# Altium schematic sheet 04 - SAMA7G54-PIO.SchDoc
size B; CompanyName: Microchip Technology Inc.; Organization: Microchip Technology; Address1: 2355 West Chandler Blvd.; Address2: Chandler, AZ  85224; Address4: USA; SheetNumber: 5; SheetTotal: 15; SheetTitle: SAMA7G5-PIO; Time: Time
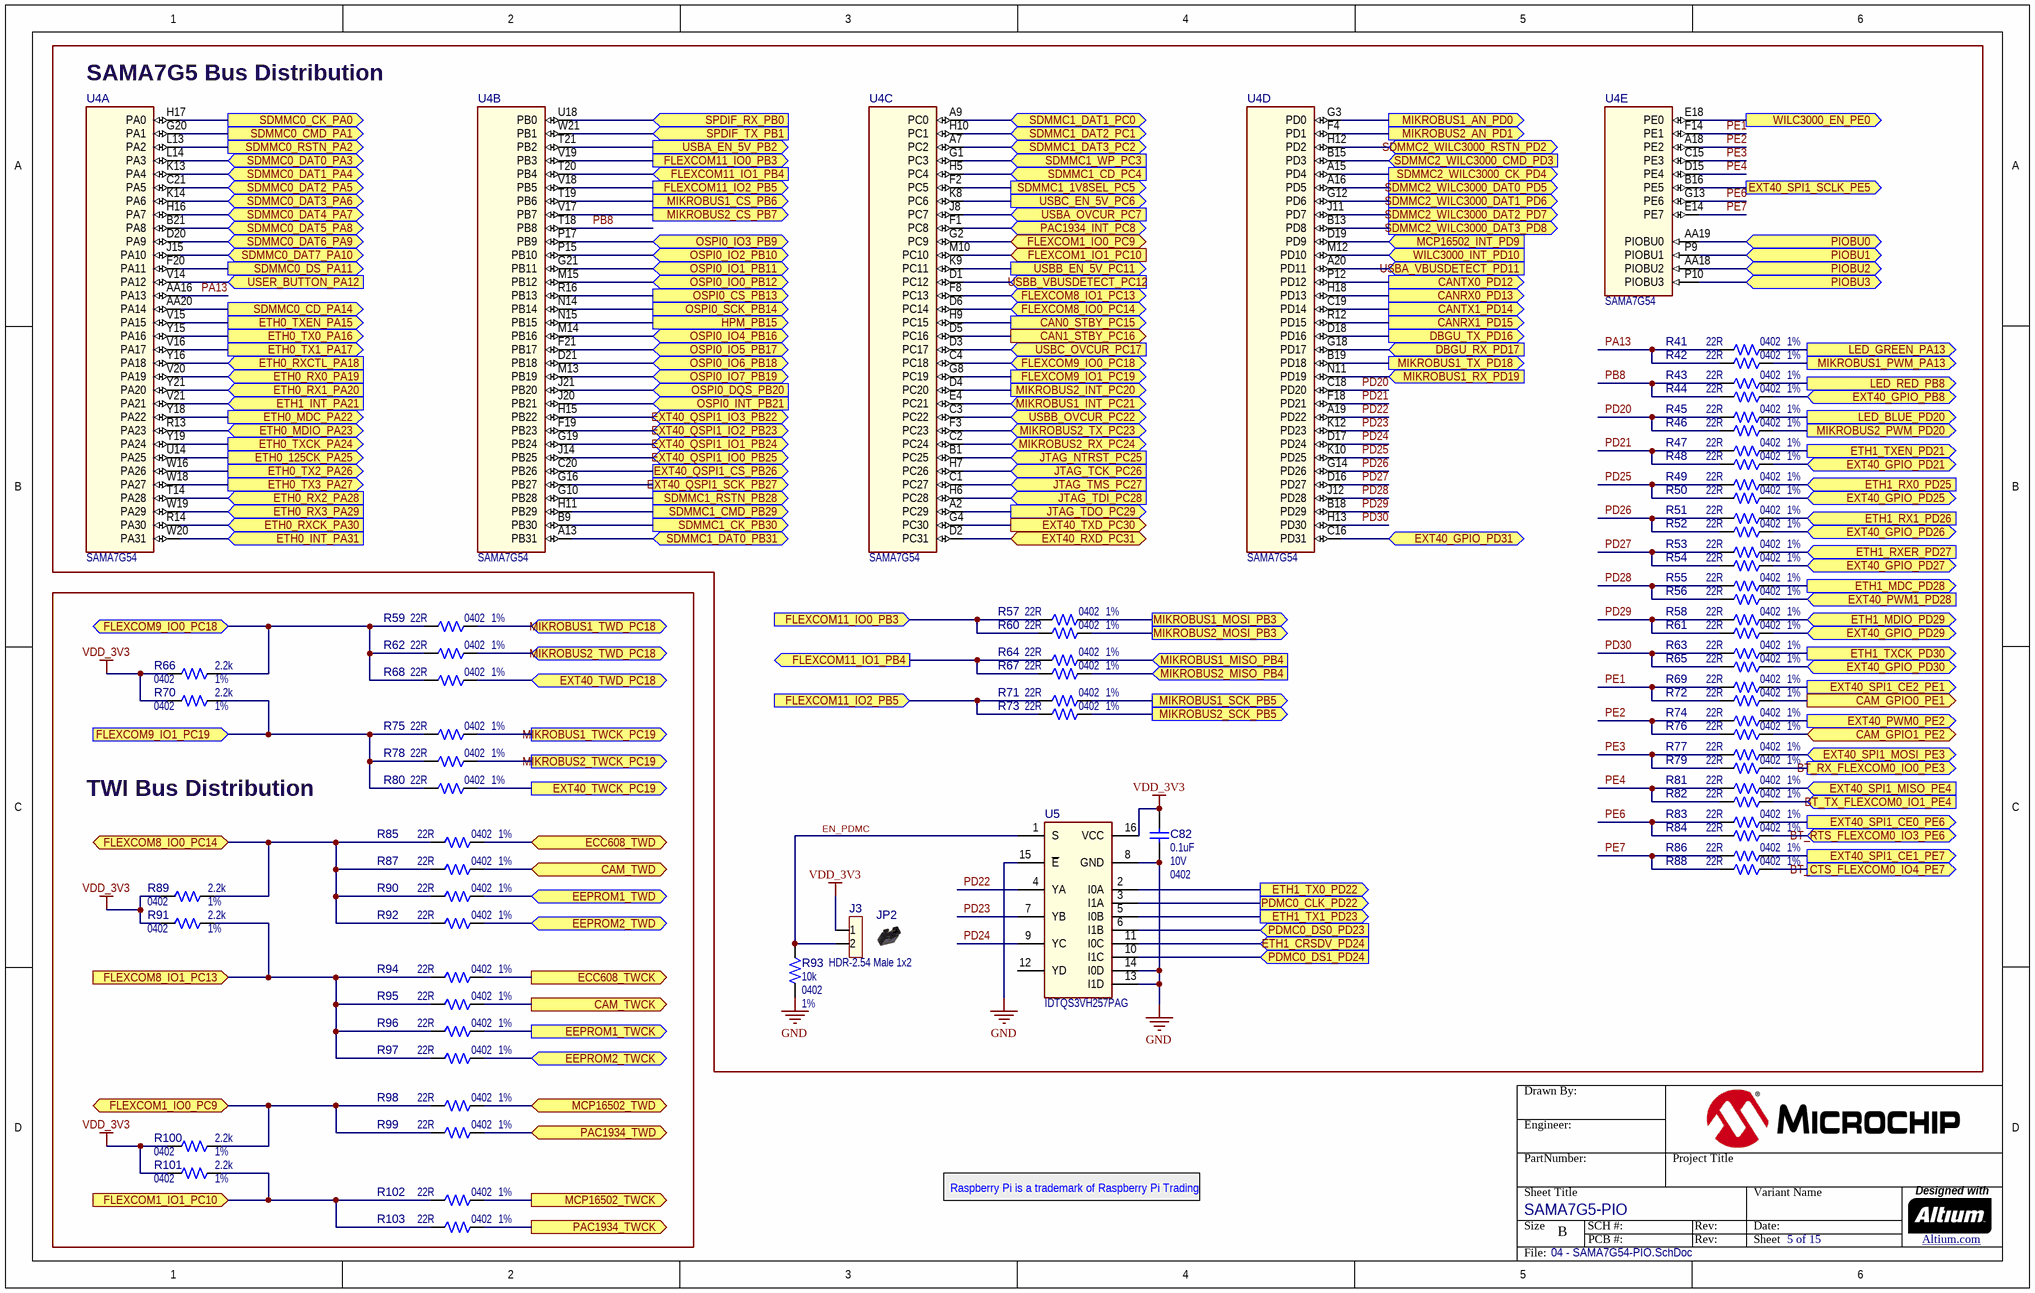
[diagram p0: 04 - SAMA7G54-PIO.SchDoc]

## Parts
?  (no value)  (graphical)
C82  value 0.1uF  Voltage: 10V  Package: 0402  [CAP_C_0402]  (hidden comment: Capacitor NP)
J3  value HDR-2.54 Male 1x2  [HDR_M_2.54_1x2]  (hidden comment: Header 1x2)
JP2  Jumper Mechanical  [Jumper_Mechanical]  (value not drawn)  (mechanical)
R41  value 22R  Package: 0402  Tolerance: 1%  [RES_C_0402]  (hidden comment: Resistor)
R42  value 22R  Package: 0402  Tolerance: 1%  [RES_C_0402]  (hidden comment: Resistor)
R43  value 22R  Package: 0402  Tolerance: 1%  [RES_C_0402]  (hidden comment: Resistor)
R44  value 22R  Package: 0402  Tolerance: 1%  [RES_C_0402]  (hidden comment: Resistor)
R45  value 22R  Package: 0402  Tolerance: 1%  [RES_C_0402]  (hidden comment: Resistor)
R46  value 22R  Package: 0402  Tolerance: 1%  [RES_C_0402]  (hidden comment: Resistor)
R47  value 22R  Package: 0402  Tolerance: 1%  [RES_C_0402]  (hidden comment: Resistor)
R48  value 22R  Package: 0402  Tolerance: 1%  [RES_C_0402]  (hidden comment: Resistor)
R49  value 22R  Package: 0402  Tolerance: 1%  [RES_C_0402]  (hidden comment: Resistor)
R50  value 22R  Package: 0402  Tolerance: 1%  [RES_C_0402]  (hidden comment: Resistor)
R51  value 22R  Package: 0402  Tolerance: 1%  [RES_C_0402]  (hidden comment: Resistor)
R52  value 22R  Package: 0402  Tolerance: 1%  [RES_C_0402]  (hidden comment: Resistor)
R53  value 22R  Package: 0402  Tolerance: 1%  [RES_C_0402]  (hidden comment: Resistor)
R54  value 22R  Package: 0402  Tolerance: 1%  [RES_C_0402]  (hidden comment: Resistor)
R55  value 22R  Package: 0402  Tolerance: 1%  [RES_C_0402]  (hidden comment: Resistor)
R56  value 22R  Package: 0402  Tolerance: 1%  [RES_C_0402]  (hidden comment: Resistor)
R57  value 22R  Package: 0402  Tolerance: 1%  [RES_C_0402]  (hidden comment: Resistor)
R58  value 22R  Package: 0402  Tolerance: 1%  [RES_C_0402]  (hidden comment: Resistor)
R59  value 22R  Package: 0402  Tolerance: 1%  [RES_C_0402]  (hidden comment: Resistor)
R60  value 22R  Package: 0402  Tolerance: 1%  [RES_C_0402]  (hidden comment: Resistor)
R61  value 22R  Package: 0402  Tolerance: 1%  [RES_C_0402]  (hidden comment: Resistor)
R62  value 22R  Package: 0402  Tolerance: 1%  [RES_C_0402]  (hidden comment: Resistor)
R63  value 22R  Package: 0402  Tolerance: 1%  [RES_C_0402]  (hidden comment: Resistor)
R64  value 22R  Package: 0402  Tolerance: 1%  [RES_C_0402]  (hidden comment: Resistor)
R65  value 22R  Package: 0402  Tolerance: 1%  [RES_C_0402]  (hidden comment: Resistor)
R66  value 2.2k  Package: 0402  Tolerance: 1%  [RES_C_0402]  (hidden comment: Resistor)
R67  value 22R  Package: 0402  Tolerance: 1%  [RES_C_0402]  (hidden comment: Resistor)
R68  value 22R  Package: 0402  Tolerance: 1%  [RES_C_0402]  (hidden comment: Resistor)
R69  value 22R  Package: 0402  Tolerance: 1%  [RES_C_0402]  (hidden comment: Resistor)
R70  value 2.2k  Package: 0402  Tolerance: 1%  [RES_C_0402]  (hidden comment: Resistor)
R71  value 22R  Package: 0402  Tolerance: 1%  [RES_C_0402]  (hidden comment: Resistor)
R72  value 22R  Package: 0402  Tolerance: 1%  [RES_C_0402]  (hidden comment: Resistor)
R73  value 22R  Package: 0402  Tolerance: 1%  [RES_C_0402]  (hidden comment: Resistor)
R74  value 22R  Package: 0402  Tolerance: 1%  [RES_C_0402]  (hidden comment: Resistor)
R75  value 22R  Package: 0402  Tolerance: 1%  [RES_C_0402]  (hidden comment: Resistor)
R76  value 22R  Package: 0402  Tolerance: 1%  [RES_C_0402]  (hidden comment: Resistor)
R77  value 22R  Package: 0402  Tolerance: 1%  [RES_C_0402]  (hidden comment: Resistor)
R78  value 22R  Package: 0402  Tolerance: 1%  [RES_C_0402]  (hidden comment: Resistor)
R79  value 22R  Package: 0402  Tolerance: 1%  [RES_C_0402]  (hidden comment: Resistor)
R80  value 22R  Package: 0402  Tolerance: 1%  [RES_C_0402]  (hidden comment: Resistor)
R81  value 22R  Package: 0402  Tolerance: 1%  [RES_C_0402]  (hidden comment: Resistor)
R82  value 22R  Package: 0402  Tolerance: 1%  [RES_C_0402]  (hidden comment: Resistor)
R83  value 22R  Package: 0402  Tolerance: 1%  [RES_C_0402]  (hidden comment: Resistor)
R84  value 22R  Package: 0402  Tolerance: 1%  [RES_C_0402]  (hidden comment: Resistor)
R85  value 22R  Package: 0402  Tolerance: 1%  [RES_C_0402]  (hidden comment: Resistor)
R86  value 22R  Package: 0402  Tolerance: 1%  [RES_C_0402]  (hidden comment: Resistor)
R87  value 22R  Package: 0402  Tolerance: 1%  [RES_C_0402]  (hidden comment: Resistor)
R88  value 22R  Package: 0402  Tolerance: 1%  [RES_C_0402]  (hidden comment: Resistor)
R89  value 2.2k  Package: 0402  Tolerance: 1%  [RES_C_0402]  (hidden comment: Resistor)
R90  value 22R  Package: 0402  Tolerance: 1%  [RES_C_0402]  (hidden comment: Resistor)
R91  value 2.2k  Package: 0402  Tolerance: 1%  [RES_C_0402]  (hidden comment: Resistor)
R92  value 22R  Package: 0402  Tolerance: 1%  [RES_C_0402]  (hidden comment: Resistor)
R93  value 10k  Package: 0402  Tolerance: 1%  [RES_C_0402]  (hidden comment: Resistor)
R94  value 22R  Package: 0402  Tolerance: 1%  [RES_C_0402]  (hidden comment: Resistor)
R95  value 22R  Package: 0402  Tolerance: 1%  [RES_C_0402]  (hidden comment: Resistor)
R96  value 22R  Package: 0402  Tolerance: 1%  [RES_C_0402]  (hidden comment: Resistor)
R97  value 22R  Package: 0402  Tolerance: 1%  [RES_C_0402]  (hidden comment: Resistor)
R98  value 22R  Package: 0402  Tolerance: 1%  [RES_C_0402]  (hidden comment: Resistor)
R99  value 22R  Package: 0402  Tolerance: 1%  [RES_C_0402]  (hidden comment: Resistor)
R100  value 2.2k  Package: 0402  Tolerance: 1%  [RES_C_0402]  (hidden comment: Resistor)
R101  value 2.2k  Package: 0402  Tolerance: 1%  [RES_C_0402]  (hidden comment: Resistor)
R102  value 22R  Package: 0402  Tolerance: 1%  [RES_C_0402]  (hidden comment: Resistor)
R103  value 22R  Package: 0402  Tolerance: 1%  [RES_C_0402]  (hidden comment: Resistor)
U4  SAMA7G54  [TFBGA-343_14x14]  (parts A,B,C,D,E of 8)
U5  value IDTQS3VH257PAG  [TSSOP-16]  (hidden comment: IDTQS3VH257 TSSOP-16)

## Blocks framed on the sheet
SAMA7G5 Bus Distribution: C82 J3 JP2 R41-R58 R60 R61 R63-R65 R67 R69 R71-R74 R76 R77 R79 R81-R84 R86 R88 R93 U4 U5
TWI Bus Distribution: R59 R62 R66 R68 R70 R75 R78 R80 R85 R87 R89-R92 R94-R103

## Ports
BT_CTS_FLEXCOM0_IO4_PE7 (out), BT_RTS_FLEXCOM0_IO3_PE6 (bidir), BT_RX_FLEXCOM0_IO0_PE3 (out), BT_TX_FLEXCOM0_IO1_PE4 (in), CAM_GPIO0_PE1 (out), CAM_GPIO1_PE2 (bidir), CAM_TWCK (out), CAM_TWD (bidir), CAN0_STBY_PC15 (out), CAN1_STBY_PC16 (out), CANRX0_PD13 (out), CANRX1_PD15 (out), CANTX0_PD12 (out), CANTX1_PD14 (out), DBGU_RX_PD17 (in), DBGU_TX_PD16 (out), ECC608_TWCK (out), ECC608_TWD (bidir), EEPROM1_TWCK (out), EEPROM1_TWD (bidir), EEPROM2_TWCK (bidir), EEPROM2_TWD (bidir), ETH0_125CK_PA25 (out), ETH0_INT_PA31 (in), ETH0_MDC_PA22 (out), ETH0_MDIO_PA23 (bidir), ETH0_RX0_PA19 (in), ETH0_RX1_PA20 (in), ETH0_RX2_PA28 (in), ETH0_RX3_PA29 (in), ETH0_RXCK_PA30 (in), ETH0_RXCTL_PA18 (in), ETH0_TX0_PA16 (out), ETH0_TX1_PA17 (out), ETH0_TX2_PA26 (out), ETH0_TX3_PA27 (out), ETH0_TXCK_PA24 (out), ETH0_TXEN_PA15 (out), ETH1_CRSDV_PD24 (in), ETH1_INT_PA21 (in), ETH1_MDC_PD28 (out), ETH1_MDIO_PD29 (bidir), ETH1_RX0_PD25 (in), ETH1_RX1_PD26 (in), ETH1_RXER_PD27 (in), ETH1_TX0_PD22 (out), ETH1_TX1_PD23 (out), ETH1_TXCK_PD30 (out), ETH1_TXEN_PD21 (out), EXT40_GPIO_PB8 (bidir), EXT40_GPIO_PD21 (bidir), EXT40_GPIO_PD25 (bidir), EXT40_GPIO_PD26 (bidir), EXT40_GPIO_PD27 (bidir), EXT40_GPIO_PD29 (bidir), EXT40_GPIO_PD30 (bidir), EXT40_GPIO_PD31 (bidir), EXT40_PWM0_PE2 (out), EXT40_PWM1_PD28 (in), EXT40_QSPI1_CS_PB26 (out), EXT40_QSPI1_IO0_PB25 (bidir), EXT40_QSPI1_IO1_PB24 (bidir), EXT40_QSPI1_IO2_PB23 (bidir), EXT40_QSPI1_IO3_PB22 (bidir), EXT40_QSPI1_SCK_PB27 (out), EXT40_RXD_PC31 (bidir), EXT40_SPI1_CE0_PE6 (out), EXT40_SPI1_CE1_PE7 (out), EXT40_SPI1_CE2_PE1 (out), EXT40_SPI1_MISO_PE4 (in), EXT40_SPI1_MOSI_PE3 (bidir), EXT40_SPI1_SCLK_PE5 (out), EXT40_TWCK_PC19 (out), EXT40_TWD_PC18 (bidir), EXT40_TXD_PC30 (out), FLEXCOM1_IO0_PC9 (bidir), FLEXCOM1_IO1_PC10 (in), FLEXCOM8_IO0_PC14 (bidir), FLEXCOM8_IO1_PC13 (bidir), FLEXCOM8_IO1_PC13 (in), FLEXCOM9_IO0_PC18 (bidir), FLEXCOM9_IO1_PC19 (in), FLEXCOM9_IO1_PC19 (out), FLEXCOM11_IO0_PB3 (in), FLEXCOM11_IO0_PB3 (out), FLEXCOM11_IO1_PB4 (in), FLEXCOM11_IO1_PB4 (out), FLEXCOM11_IO2_PB5 (in), FLEXCOM11_IO2_PB5 (out), HPM_PB15 (out), JTAG_NTRST_PC25 (in), JTAG_TCK_PC26 (in), JTAG_TDI_PC28 (in), JTAG_TDO_PC29 (out), JTAG_TMS_PC27 (in), LED_BLUE_PD20 (out), LED_GREEN_PA13 (out), LED_RED_PB8 (out), MCP16502_INT_PD9 (in), MCP16502_TWCK (out), MCP16502_TWD (bidir), MIKROBUS1_AN_PD0 (out), MIKROBUS1_CS_PB6 (out), MIKROBUS1_INT_PC21 (bidir), MIKROBUS1_MISO_PB4 (in), MIKROBUS1_MOSI_PB3 (out), MIKROBUS1_PWM_PA13 (out), MIKROBUS1_RX_PD19 (in), MIKROBUS1_SCK_PB5 (out), MIKROBUS1_TWCK_PC19 (out), MIKROBUS1_TWD_PC18 (bidir), MIKROBUS1_TX_PD18 (out), MIKROBUS2_AN_PD1 (out), MIKROBUS2_CS_PB7 (out), MIKROBUS2_INT_PC20 (out), MIKROBUS2_MISO_PB4 (in), MIKROBUS2_MOSI_PB3 (out), MIKROBUS2_PWM_PD20 (out), MIKROBUS2_RX_PC24 (bidir), MIKROBUS2_SCK_PB5 (out), MIKROBUS2_TWCK_PC19 (out), MIKROBUS2_TWD_PC18 (bidir), MIKROBUS2_TX_PC23 (bidir), OSPI0_CS_PB13 (out), OSPI0_DQS_PB20 (in), OSPI0_INT_PB21 (in), OSPI0_IO0_PB12 (bidir), OSPI0_IO1_PB11 (bidir), OSPI0_IO2_PB10 (bidir), OSPI0_IO3_PB9 (bidir), OSPI0_IO4_PB16 (bidir), OSPI0_IO5_PB17 (bidir), OSPI0_IO6_PB18 (bidir), OSPI0_IO7_PB19 (bidir), OSPI0_SCK_PB14 (out), PAC1934_INT_PC8 (bidir), PAC1934_TWCK (out), PAC1934_TWD (bidir), PDMC0_CLK_PD22 (out), PDMC0_DS0_PD23 (in), PDMC0_DS1_PD24 (in), PIOBU0 (bidir), PIOBU1 (bidir), PIOBU2 (bidir), PIOBU3 (bidir), SDMMC0_CD_PA14 (out), SDMMC0_CK_PA0 (out), SDMMC0_CMD_PA1 (out), SDMMC0_DAT0_PA3 (bidir), SDMMC0_DAT1_PA4 (bidir), SDMMC0_DAT2_PA5 (bidir), SDMMC0_DAT3_PA6 (bidir), SDMMC0_DAT4_PA7 (bidir), SDMMC0_DAT5_PA8 (bidir), SDMMC0_DAT6_PA9 (bidir), SDMMC0_DAT7_PA10 (bidir), SDMMC0_DS_PA11 (out), SDMMC0_RSTN_PA2 (out), SDMMC1_1V8SEL_PC5 (out), SDMMC1_CD_PC4 (in), SDMMC1_CK_PB30 (out), SDMMC1_CMD_PB29 (out), SDMMC1_DAT0_PB31 (bidir), SDMMC1_DAT1_PC0 (bidir), SDMMC1_DAT2_PC1 (bidir), SDMMC1_DAT3_PC2 (bidir), SDMMC1_RSTN_PB28 (out), SDMMC1_WP_PC3 (in), SDMMC2_WILC3000_CK_PD4 (out), SDMMC2_WILC3000_CMD_PD3 (in), SDMMC2_WILC3000_DAT0_PD5 (out), SDMMC2_WILC3000_DAT1_PD6 (out), SDMMC2_WILC3000_DAT2_PD7 (out), SDMMC2_WILC3000_DAT3_PD8 (out), SDMMC2_WILC3000_RSTN_PD2 (bidir), SPDIF_RX_PB0 (in), SPDIF_TX_PB1 (in), USBA_EN_5V_PB2 (out), USBA_OVCUR_PC7 (in), USBA_VBUSDETECT_PD11 (in), USBB_EN_5V_PC11 (out), USBB_OVCUR_PC22 (bidir), USBB_VBUSDETECT_PC12 (in), USBC_EN_5V_PC6 (out), USBC_OVCUR_PC17 (in), USER_BUTTON_PA12 (in), WILC3000_EN_PE0 (out), WILC3000_INT_PD10 (in)

## Nets
GND: C82.2 R93.2 U5.8(GND) U5.13(I1D) U5.14(I0D) U5.15(~{E})
VDD_3V3: C82.1 J3.1 R66.2 R70.2 R89.2 R91.2 R100.2 R101.2 U5.16(VCC)
BT_CTS_FLEXCOM0_IO4_PE7: R88.2 ; port BT_CTS_FLEXCOM0_IO4_PE7
BT_RTS_FLEXCOM0_IO3_PE6: R84.2 ; port BT_RTS_FLEXCOM0_IO3_PE6
BT_RX_FLEXCOM0_IO0_PE3: R79.2 ; port BT_RX_FLEXCOM0_IO0_PE3
BT_TX_FLEXCOM0_IO1_PE4: R82.2 ; port BT_TX_FLEXCOM0_IO1_PE4
CAM_GPIO0_PE1: R72.2 ; port CAM_GPIO0_PE1
CAM_GPIO1_PE2: R76.2 ; port CAM_GPIO1_PE2
CAM_TWCK: R95.2 ; port CAM_TWCK
CAM_TWD: R87.2 ; port CAM_TWD
CAN0_STBY_PC15: U4.H9(PC15) ; port CAN0_STBY_PC15
CAN1_STBY_PC16: U4.D5(PC16) ; port CAN1_STBY_PC16
CANRX0_PD13: U4.H18(PD13) ; port CANRX0_PD13
CANRX1_PD15: U4.R12(PD15) ; port CANRX1_PD15
CANTX0_PD12: U4.P12(PD12) ; port CANTX0_PD12
CANTX1_PD14: U4.C19(PD14) ; port CANTX1_PD14
DBGU_RX_PD17: U4.G18(PD17) ; port DBGU_RX_PD17
DBGU_TX_PD16: U4.D18(PD16) ; port DBGU_TX_PD16
ECC608_TWCK: R94.2 ; port ECC608_TWCK
ECC608_TWD: R85.2 ; port ECC608_TWD
EEPROM1_TWCK: R96.2 ; port EEPROM1_TWCK
EEPROM1_TWD: R90.2 ; port EEPROM1_TWD
EEPROM2_TWCK: R97.2 ; port EEPROM2_TWCK
EEPROM2_TWD: R92.2 ; port EEPROM2_TWD
EN_PDMC: J3.2 R93.1 U5.1(S)
ETH0_125CK_PA25: U4.U14(PA25) ; port ETH0_125CK_PA25
ETH0_INT_PA31: U4.W20(PA31) ; port ETH0_INT_PA31
ETH0_MDC_PA22: U4.Y18(PA22) ; port ETH0_MDC_PA22
ETH0_MDIO_PA23: U4.R13(PA23) ; port ETH0_MDIO_PA23
ETH0_RX0_PA19: U4.V20(PA19) ; port ETH0_RX0_PA19
ETH0_RX1_PA20: U4.Y21(PA20) ; port ETH0_RX1_PA20
ETH0_RX2_PA28: U4.T14(PA28) ; port ETH0_RX2_PA28
ETH0_RX3_PA29: U4.W19(PA29) ; port ETH0_RX3_PA29
ETH0_RXCK_PA30: U4.R14(PA30) ; port ETH0_RXCK_PA30
ETH0_RXCTL_PA18: U4.Y16(PA18) ; port ETH0_RXCTL_PA18
ETH0_TX0_PA16: U4.Y15(PA16) ; port ETH0_TX0_PA16
ETH0_TX1_PA17: U4.V16(PA17) ; port ETH0_TX1_PA17
ETH0_TX2_PA26: U4.W16(PA26) ; port ETH0_TX2_PA26
ETH0_TX3_PA27: U4.W18(PA27) ; port ETH0_TX3_PA27
ETH0_TXCK_PA24: U4.Y19(PA24) ; port ETH0_TXCK_PA24
ETH0_TXEN_PA15: U4.V15(PA15) ; port ETH0_TXEN_PA15
ETH1_CRSDV_PD24: U5.11(I0C) ; port ETH1_CRSDV_PD24
ETH1_INT_PA21: U4.V21(PA21) ; port ETH1_INT_PA21
ETH1_MDC_PD28: R55.2 ; port ETH1_MDC_PD28
ETH1_MDIO_PD29: R58.2 ; port ETH1_MDIO_PD29
ETH1_RX0_PD25: R49.2 ; port ETH1_RX0_PD25
ETH1_RX1_PD26: R51.2 ; port ETH1_RX1_PD26
ETH1_RXER_PD27: R53.2 ; port ETH1_RXER_PD27
ETH1_TX0_PD22: U5.2(I0A) ; port ETH1_TX0_PD22
ETH1_TX1_PD23: U5.5(I0B) ; port ETH1_TX1_PD23
ETH1_TXCK_PD30: R63.2 ; port ETH1_TXCK_PD30
ETH1_TXEN_PD21: R47.2 ; port ETH1_TXEN_PD21
EXT40_GPIO_PB8: R44.2 ; port EXT40_GPIO_PB8
EXT40_GPIO_PD21: R48.2 ; port EXT40_GPIO_PD21
EXT40_GPIO_PD25: R50.2 ; port EXT40_GPIO_PD25
EXT40_GPIO_PD26: R52.2 ; port EXT40_GPIO_PD26
EXT40_GPIO_PD27: R54.2 ; port EXT40_GPIO_PD27
EXT40_GPIO_PD29: R61.2 ; port EXT40_GPIO_PD29
EXT40_GPIO_PD30: R65.2 ; port EXT40_GPIO_PD30
EXT40_GPIO_PD31: U4.C16(PD31) ; port EXT40_GPIO_PD31
EXT40_PWM0_PE2: R74.2 ; port EXT40_PWM0_PE2
EXT40_PWM1_PD28: R56.2 ; port EXT40_PWM1_PD28
EXT40_QSPI1_CS_PB26: U4.C20(PB26) ; port EXT40_QSPI1_CS_PB26
EXT40_QSPI1_IO0_PB25: U4.J14(PB25) ; port EXT40_QSPI1_IO0_PB25
EXT40_QSPI1_IO1_PB24: U4.G19(PB24) ; port EXT40_QSPI1_IO1_PB24
EXT40_QSPI1_IO2_PB23: U4.F19(PB23) ; port EXT40_QSPI1_IO2_PB23
EXT40_QSPI1_IO3_PB22: U4.H15(PB22) ; port EXT40_QSPI1_IO3_PB22
EXT40_QSPI1_SCK_PB27: U4.G16(PB27) ; port EXT40_QSPI1_SCK_PB27
EXT40_RXD_PC31: U4.D2(PC31) ; port EXT40_RXD_PC31
EXT40_SPI1_CE0_PE6: R83.2 ; port EXT40_SPI1_CE0_PE6
EXT40_SPI1_CE1_PE7: R86.2 ; port EXT40_SPI1_CE1_PE7
EXT40_SPI1_CE2_PE1: R69.2 ; port EXT40_SPI1_CE2_PE1
EXT40_SPI1_MISO_PE4: R81.2 ; port EXT40_SPI1_MISO_PE4
EXT40_SPI1_MOSI_PE3: R77.2 ; port EXT40_SPI1_MOSI_PE3
EXT40_SPI1_SCLK_PE5: U4.B16(PE5) ; port EXT40_SPI1_SCLK_PE5
EXT40_TWCK_PC19: R80.2 ; port EXT40_TWCK_PC19
EXT40_TWD_PC18: R68.2 ; port EXT40_TWD_PC18
EXT40_TXD_PC30: U4.G4(PC30) ; port EXT40_TXD_PC30
FLEXCOM1_IO0_PC9: R98.1 R99.1 R100.1 U4.G2(PC9) ; port FLEXCOM1_IO0_PC9
FLEXCOM1_IO1_PC10: R101.1 R102.1 R103.1 U4.M10(PC10) ; port FLEXCOM1_IO1_PC10
FLEXCOM8_IO0_PC14: R85.1 R87.1 R89.1 R90.1 R92.1 U4.D6(PC14) ; port FLEXCOM8_IO0_PC14
FLEXCOM8_IO1_PC13: R91.1 R94.1 R95.1 R96.1 R97.1 U4.F8(PC13) ; port FLEXCOM8_IO1_PC13
FLEXCOM9_IO0_PC18: R59.1 R62.1 R66.1 R68.1 U4.C4(PC18) ; port FLEXCOM9_IO0_PC18
FLEXCOM9_IO1_PC19: R70.1 R75.1 R78.1 R80.1 U4.G8(PC19) ; port FLEXCOM9_IO1_PC19
FLEXCOM11_IO0_PB3: R57.1 R60.1 U4.V19(PB3) ; port FLEXCOM11_IO0_PB3
FLEXCOM11_IO1_PB4: R64.1 R67.1 U4.T20(PB4) ; port FLEXCOM11_IO1_PB4
FLEXCOM11_IO2_PB5: R71.1 R73.1 U4.V18(PB5) ; port FLEXCOM11_IO2_PB5
HPM_PB15: U4.N15(PB15) ; port HPM_PB15
JTAG_NTRST_PC25: U4.B1(PC25) ; port JTAG_NTRST_PC25
JTAG_TCK_PC26: U4.H7(PC26) ; port JTAG_TCK_PC26
JTAG_TDI_PC28: U4.H6(PC28) ; port JTAG_TDI_PC28
JTAG_TDO_PC29: U4.A2(PC29) ; port JTAG_TDO_PC29
JTAG_TMS_PC27: U4.C1(PC27) ; port JTAG_TMS_PC27
LED_BLUE_PD20: R45.2 ; port LED_BLUE_PD20
LED_GREEN_PA13: R41.2 ; port LED_GREEN_PA13
LED_RED_PB8: R43.2 ; port LED_RED_PB8
MCP16502_INT_PD9: U4.D19(PD9) ; port MCP16502_INT_PD9
MCP16502_TWCK: R102.2 ; port MCP16502_TWCK
MCP16502_TWD: R98.2 ; port MCP16502_TWD
MIKROBUS1_AN_PD0: U4.G3(PD0) ; port MIKROBUS1_AN_PD0
MIKROBUS1_CS_PB6: U4.T19(PB6) ; port MIKROBUS1_CS_PB6
MIKROBUS1_INT_PC21: U4.E4(PC21) ; port MIKROBUS1_INT_PC21
MIKROBUS1_MISO_PB4: R64.2 ; port MIKROBUS1_MISO_PB4
MIKROBUS1_MOSI_PB3: R57.2 ; port MIKROBUS1_MOSI_PB3
MIKROBUS1_PWM_PA13: R42.2 ; port MIKROBUS1_PWM_PA13
MIKROBUS1_RX_PD19: U4.N11(PD19) ; port MIKROBUS1_RX_PD19
MIKROBUS1_SCK_PB5: R71.2 ; port MIKROBUS1_SCK_PB5
MIKROBUS1_TWCK_PC19: R75.2 ; port MIKROBUS1_TWCK_PC19
MIKROBUS1_TWD_PC18: R59.2 ; port MIKROBUS1_TWD_PC18
MIKROBUS1_TX_PD18: U4.B19(PD18) ; port MIKROBUS1_TX_PD18
MIKROBUS2_AN_PD1: U4.F4(PD1) ; port MIKROBUS2_AN_PD1
MIKROBUS2_CS_PB7: U4.V17(PB7) ; port MIKROBUS2_CS_PB7
MIKROBUS2_INT_PC20: U4.D4(PC20) ; port MIKROBUS2_INT_PC20
MIKROBUS2_MISO_PB4: R67.2 ; port MIKROBUS2_MISO_PB4
MIKROBUS2_MOSI_PB3: R60.2 ; port MIKROBUS2_MOSI_PB3
MIKROBUS2_PWM_PD20: R46.2 ; port MIKROBUS2_PWM_PD20
MIKROBUS2_RX_PC24: U4.C2(PC24) ; port MIKROBUS2_RX_PC24
MIKROBUS2_SCK_PB5: R73.2 ; port MIKROBUS2_SCK_PB5
MIKROBUS2_TWCK_PC19: R78.2 ; port MIKROBUS2_TWCK_PC19
MIKROBUS2_TWD_PC18: R62.2 ; port MIKROBUS2_TWD_PC18
MIKROBUS2_TX_PC23: U4.F3(PC23) ; port MIKROBUS2_TX_PC23
OSPI0_CS_PB13: U4.R16(PB13) ; port OSPI0_CS_PB13
OSPI0_DQS_PB20: U4.J21(PB20) ; port OSPI0_DQS_PB20
OSPI0_INT_PB21: U4.J20(PB21) ; port OSPI0_INT_PB21
OSPI0_IO0_PB12: U4.M15(PB12) ; port OSPI0_IO0_PB12
OSPI0_IO1_PB11: U4.G21(PB11) ; port OSPI0_IO1_PB11
OSPI0_IO2_PB10: U4.P15(PB10) ; port OSPI0_IO2_PB10
OSPI0_IO3_PB9: U4.P17(PB9) ; port OSPI0_IO3_PB9
OSPI0_IO4_PB16: U4.M14(PB16) ; port OSPI0_IO4_PB16
OSPI0_IO5_PB17: U4.F21(PB17) ; port OSPI0_IO5_PB17
OSPI0_IO6_PB18: U4.D21(PB18) ; port OSPI0_IO6_PB18
OSPI0_IO7_PB19: U4.M13(PB19) ; port OSPI0_IO7_PB19
OSPI0_SCK_PB14: U4.N14(PB14) ; port OSPI0_SCK_PB14
PA13: R41.1 R42.1 U4.AA16(PA13)
PAC1934_INT_PC8: U4.F1(PC8) ; port PAC1934_INT_PC8
PAC1934_TWCK: R103.2 ; port PAC1934_TWCK
PAC1934_TWD: R99.2 ; port PAC1934_TWD
PB8: R43.1 R44.1 U4.T18(PB8)
PD20: R45.1 R46.1 U4.C18(PD20)
PD21: R47.1 R48.1 U4.F18(PD21)
PD22: U4.A19(PD22) U5.4(YA)
PD23: U4.K12(PD23) U5.7(YB)
PD24: U4.D17(PD24) U5.9(YC)
PD25: R49.1 R50.1 U4.K10(PD25)
PD26: R51.1 R52.1 U4.G14(PD26)
PD27: R53.1 R54.1 U4.D16(PD27)
PD28: R55.1 R56.1 U4.J12(PD28)
PD29: R58.1 R61.1 U4.B18(PD29)
PD30: R63.1 R65.1 U4.H13(PD30)
PDMC0_CLK_PD22: U5.3(I1A) ; port PDMC0_CLK_PD22
PDMC0_DS0_PD23: U5.6(I1B) ; port PDMC0_DS0_PD23
PDMC0_DS1_PD24: U5.10(I1C) ; port PDMC0_DS1_PD24
PE1: R69.1 R72.1 U4.F14(PE1)
PE2: R74.1 R76.1 U4.A18(PE2)
PE3: R77.1 R79.1 U4.C15(PE3)
PE4: R81.1 R82.1 U4.D15(PE4)
PE6: R83.1 R84.1 U4.G13(PE6)
PE7: R86.1 R88.1 U4.E14(PE7)
PIOBU0: U4.AA19(PIOBU0) ; port PIOBU0
PIOBU1: U4.P9(PIOBU1) ; port PIOBU1
PIOBU2: U4.AA18(PIOBU2) ; port PIOBU2
PIOBU3: U4.P10(PIOBU3) ; port PIOBU3
SDMMC0_CD_PA14: U4.AA20(PA14) ; port SDMMC0_CD_PA14
SDMMC0_CK_PA0: U4.H17(PA0) ; port SDMMC0_CK_PA0
SDMMC0_CMD_PA1: U4.G20(PA1) ; port SDMMC0_CMD_PA1
SDMMC0_DAT0_PA3: U4.L14(PA3) ; port SDMMC0_DAT0_PA3
SDMMC0_DAT1_PA4: U4.K13(PA4) ; port SDMMC0_DAT1_PA4
SDMMC0_DAT2_PA5: U4.C21(PA5) ; port SDMMC0_DAT2_PA5
SDMMC0_DAT3_PA6: U4.K14(PA6) ; port SDMMC0_DAT3_PA6
SDMMC0_DAT4_PA7: U4.H16(PA7) ; port SDMMC0_DAT4_PA7
SDMMC0_DAT5_PA8: U4.B21(PA8) ; port SDMMC0_DAT5_PA8
SDMMC0_DAT6_PA9: U4.D20(PA9) ; port SDMMC0_DAT6_PA9
SDMMC0_DAT7_PA10: U4.J15(PA10) ; port SDMMC0_DAT7_PA10
SDMMC0_DS_PA11: U4.F20(PA11) ; port SDMMC0_DS_PA11
SDMMC0_RSTN_PA2: U4.L13(PA2) ; port SDMMC0_RSTN_PA2
SDMMC1_1V8SEL_PC5: U4.F2(PC5) ; port SDMMC1_1V8SEL_PC5
SDMMC1_CD_PC4: U4.H5(PC4) ; port SDMMC1_CD_PC4
SDMMC1_CK_PB30: U4.B9(PB30) ; port SDMMC1_CK_PB30
SDMMC1_CMD_PB29: U4.H11(PB29) ; port SDMMC1_CMD_PB29
SDMMC1_DAT0_PB31: U4.A13(PB31) ; port SDMMC1_DAT0_PB31
SDMMC1_DAT1_PC0: U4.A9(PC0) ; port SDMMC1_DAT1_PC0
SDMMC1_DAT2_PC1: U4.H10(PC1) ; port SDMMC1_DAT2_PC1
SDMMC1_DAT3_PC2: U4.A7(PC2) ; port SDMMC1_DAT3_PC2
SDMMC1_RSTN_PB28: U4.G10(PB28) ; port SDMMC1_RSTN_PB28
SDMMC1_WP_PC3: U4.G1(PC3) ; port SDMMC1_WP_PC3
SDMMC2_WILC3000_CK_PD4: U4.A15(PD4) ; port SDMMC2_WILC3000_CK_PD4
SDMMC2_WILC3000_CMD_PD3: U4.B15(PD3) ; port SDMMC2_WILC3000_CMD_PD3
SDMMC2_WILC3000_DAT0_PD5: U4.A16(PD5) ; port SDMMC2_WILC3000_DAT0_PD5
SDMMC2_WILC3000_DAT1_PD6: U4.G12(PD6) ; port SDMMC2_WILC3000_DAT1_PD6
SDMMC2_WILC3000_DAT2_PD7: U4.J11(PD7) ; port SDMMC2_WILC3000_DAT2_PD7
SDMMC2_WILC3000_DAT3_PD8: U4.B13(PD8) ; port SDMMC2_WILC3000_DAT3_PD8
SDMMC2_WILC3000_RSTN_PD2: U4.H12(PD2) ; port SDMMC2_WILC3000_RSTN_PD2
SPDIF_RX_PB0: U4.U18(PB0) ; port SPDIF_RX_PB0
SPDIF_TX_PB1: U4.W21(PB1) ; port SPDIF_TX_PB1
USBA_EN_5V_PB2: U4.T21(PB2) ; port USBA_EN_5V_PB2
USBA_OVCUR_PC7: U4.J8(PC7) ; port USBA_OVCUR_PC7
USBA_VBUSDETECT_PD11: U4.A20(PD11) ; port USBA_VBUSDETECT_PD11
USBB_EN_5V_PC11: U4.K9(PC11) ; port USBB_EN_5V_PC11
USBB_OVCUR_PC22: U4.C3(PC22) ; port USBB_OVCUR_PC22
USBB_VBUSDETECT_PC12: U4.D1(PC12) ; port USBB_VBUSDETECT_PC12
USBC_EN_5V_PC6: U4.K8(PC6) ; port USBC_EN_5V_PC6
USBC_OVCUR_PC17: U4.D3(PC17) ; port USBC_OVCUR_PC17
USER_BUTTON_PA12: U4.V14(PA12) ; port USER_BUTTON_PA12
WILC3000_EN_PE0: U4.E18(PE0) ; port WILC3000_EN_PE0
WILC3000_INT_PD10: U4.M12(PD10) ; port WILC3000_INT_PD10

Not connected (* = marked no-connect by the designer): U5 12(YD)

## Notes on the sheet
- Raspberry Pi is a trademark of Raspberry Pi Trading
- Drawn By:
- Engineer:
- PartNumber:
- Project Title
- Sheet Title
- Size
- B
- SCH #:
- PCB #:
- Rev:
- Variant Name
- Date:
- Sheet
- Designed with
- Altium.com <http://go.altium.com/MicrochipLandingPage_Evaluation.html>
- File:

## Library data of the parts
? = Title Block B
C82 = CAP1238: Capacitor; Manufacturer 1: KEMET; Manufacturer Part Number 1: C0402C104K8RACTU; Description_: CAP CER 0.1uF 10V 10% X7R SMD 0402; Dev Tools Status: Production; Tolerance: 10%; Temperature Coeffcient: X7R; Type: Ceramic; Owner: Tad Ahlvers; Populated: YES; MCHP-ID: CAP1238; Revision: 1; Symbol: Capacitor NP; Status: MCL Design; ComponentLink1URL: https://chn-vm-apps.microchip.com/mchprepo/parts/Datasheets/KEM_C1002_X7R_SMD.pdf; ComponentLink1Description: SVN Datasheet; ComponentLink2URL: C:\ALTIUM_WORK\00001_MCHP-CDB\Datasheets\KEM_C1002_X7R_SMD.pdf; ComponentLink2Description: Local Datasheet; ComponentLink3URL: C:\ALTIUM_WORK\00001_MCHP-CDB\Library\LibraryRefs\Capacitor NP.SchLib; ComponentLink3Description: Open Symbol; ComponentLink4URL: C:\ALTIUM_WORK\00001_MCHP-CDB\Library\Footprints\CAP_C_0402.PcbLib; ComponentLink4Description: Open Footprint; ComponentLink5Description: Open Footprint 2; ComponentLink6Description: Open Footprint 3; ComponentLink7Description: Open Footprint 4; Operating Temperature: -55C to +125C; Category: Capacitor; Supplier 1: Digi-Key; Supplier Part Number 1: 399-3520-2-ND; Quantity Override: 1; Manufacturer 2: Samsung; Manufacturer Part Number 2: CL05B104KP5NNNC; Manufacturer 3: Murata Electronics; Manufacturer Part Number 3: GRM155R71A104KA01D; Supplier 2: Digi-Key; Supplier Part Number 2: 1276-1002-2-ND; Supplier 3: Mouser; Supplier Part Number 3: 81-GRM155R71A104KA1D
J3 = CON1312: Manufacturer 1: Sullins Connector Solutions; Manufacturer Part Number 1: PREC002SAAN-RC; Description_: CON HDR-2.54 Male 1x2 Tin 5.84MH TH VERT; Dev Tools Status: Production; Owner: Randolph Sobrepena; Populated: YES; MCHP-ID: CON1312; Revision: 2; Symbol: Header 1x2; Status: MCL Design; ComponentLink1URL: https://chn-vm-apps.microchip.com/mchprepo/parts/Datasheets/z RzCzzzSzzN-RC, ST,11635-B.pdf; ComponentLink1Description: SVN Datasheet; ComponentLink2URL: C:\ALTIUM_WORK\00001_MCHP-CDB\Datasheets\z RzCzzzSzzN-RC, ST,11635-B.pdf; ComponentLink2Description: Local Datasheet; ComponentLink3URL: C:\ALTIUM_WORK\00001_MCHP-CDB\Library\LibraryRefs\Header 1x2.SchLib; ComponentLink3Description: Open Symbol; ComponentLink4URL: C:\ALTIUM_WORK\00001_MCHP-CDB\Library\Footprints\HDR_M_2.54_1x2.PcbLib; ComponentLink4Description: Open Footprint; ComponentLink5Description: Open Footprint 2; ComponentLink6Description: Open Footprint 3; ComponentLink7Description: Open Footprint 4; Type: Header 2.54mm; Category: Connector; Manufacturer 2: SHENZHEN JUNHAO ENGINEERING; Manufacturer Part Number 2: R-211-0211-0021-000; Supplier 1: Digi-Key; Supplier Part Number 1: S1012EC-02-ND; Supplier 2: Raynen; Supplier Part Number 2: CONN00252C01M; Quantity Override: 1
JP2 = MECH0174: Manufacturer 1: Wurth Electronics Inc.; Manufacturer Part Number 1: 60900213421; Value: Shunt 2.54mm 1x2; Description_: MECH HW JUMPER 2.54mm 1x2 GOLD; Dev Tools Status: Production; Owner: Narasimha Murthy; Populated: MECH; MCHP-ID: MECH0174; Revision: 1; Symbol: Jumper Mechanical; Status: MCL Design; ComponentLink1URL: https://chn-vm-apps.microchip.com/mchprepo/parts/Datasheets/60900213421.pdf; ComponentLink1Description: SVN Datasheet; ComponentLink2URL: C:\ALTIUM_WORK\00001_MCHP-CDB\Datasheets\60900213421.pdf; ComponentLink2Description: Local Datasheet; ComponentLink3URL: C:\ALTIUM_WORK\00001_MCHP-CDB\Library\LibraryRefs\Jumper Mechanical.SchLib; ComponentLink3Description: Open Symbol; ComponentLink4URL: C:\ALTIUM_WORK\00001_MCHP-CDB\Library\Footprints\Jumper_Mechanical.PcbLib; ComponentLink4Description: Open Footprint; ComponentLink5Description: Open Footprint 2; ComponentLink6Description: Open Footprint 3; ComponentLink7Description: Open Footprint 4; Type: Jumper; Category: Hardware; Supplier 1: Digi-Key; Supplier Part Number 1: 732-2678-ND; Quantity Override: 1
R41-R65 R67-R69 R71-R88 R90 R92 R94-R99 R102 R103 = RES1474: Manufacturer 1: Panasonic Electronic Components; Manufacturer Part Number 1: ERJ-2RKF22R0X; Description_: RES TKF 22R 1% 1/20W SMD 0402; Dev Tools Status: Production; Temperature Coeffcient: 100ppm/C; Circuit Type: Isolated; Power: 1/10W; Owner: Mike Ragsdale; Populated: YES; MCHP-ID: RES1474; Revision: 1; Symbol: Resistor; Status: MCL Design; ComponentLink1Description: SVN Datasheet; ComponentLink2Description: Local Datasheet; ComponentLink3URL: C:\ALTIUM_WORK\00001_MCHP-CDB\Library\LibraryRefs\Resistor.SchLib; ComponentLink3Description: Open Symbol; ComponentLink4URL: C:\ALTIUM_WORK\00001_MCHP-CDB\Library\Footprints\RES_C_0402.PcbLib; ComponentLink4Description: Open Footprint; ComponentLink5Description: Open Footprint 2; ComponentLink6Description: Open Footprint 3; ComponentLink7Description: Open Footprint 4; Operating Temperature: -55C to +155C; Category: Resistor; Type: RES SMD; Composition: TKF; Supplier 1: Digi-Key; Supplier Part Number 1: P22.0LCT-ND; Quantity Override: 1
R66 R70 R89 R91 R100 R101 = RES1023: Manufacturer 1: Panasonic; Manufacturer Part Number 1: ERJ-2RKF2201X; Description_: RES TKF 2.2k 1% 1/10W SMD 0402; Dev Tools Status: Production; Voltage: 50V; Temperature Coeffcient: 100ppm/C; Power: 1/10W; Owner: Tad Ahlvers; Populated: YES; MCHP-ID: RES1023; Revision: 1; Symbol: Resistor; Status: MCL Design; ComponentLink1URL: https://chn-vm-apps.microchip.com/mchprepo/parts/Datasheets/AOA0000CE2.pdf; ComponentLink1Description: SVN Datasheet; ComponentLink2URL: C:\ALTIUM_WORK\00001_MCHP-CDB\Datasheets\AOA0000CE2.pdf; ComponentLink2Description: Local Datasheet; ComponentLink3URL: C:\ALTIUM_WORK\00001_MCHP-CDB\Library\LibraryRefs\Resistor.SchLib; ComponentLink3Description: Open Symbol; ComponentLink4URL: C:\ALTIUM_WORK\00001_MCHP-CDB\Library\Footprints\RES_C_0402.PcbLib; ComponentLink4Description: Open Footprint; ComponentLink5Description: Open Footprint 2; ComponentLink6Description: Open Footprint 3; ComponentLink7Description: Open Footprint 4; Operating Temperature: -55C to +155C; Category: Resistor; Type: RES SMD; Composition: TKF; Supplier 1: Digi-Key; Supplier Part Number 1: P2.20KLTR-ND; Quantity Override: 1
R93 = RSMT1019: Manufacturer 1: Panasonic; Manufacturer Part Number 1: ERJ-2RKF1002X; Description_: RES TKF 10k 1% 1/10W SMD 0402; Dev Tools Status: Production; Voltage: 50V; Temperature Coeffcient: 100ppm/C; Power: 1/10W; Populated: Yes; Owner: Brent Lanphear; MCHP-ID: RSMT1019; Revision: 2; Symbol: Resistor; Status: MCL Design; ComponentLink1URL: https://chn-vm-apps.microchip.com/mchprepo/parts/Datasheets/AOA0000CE2.pdf; ComponentLink1Description: SVN Datasheet; ComponentLink2URL: C:\ALTIUM_WORK\00001_MCHP-CDB\Datasheets\AOA0000CE2.pdf; ComponentLink2Description: Local Datasheet; ComponentLink3URL: C:\ALTIUM_WORK\00001_MCHP-CDB\Library\LibraryRefs\Resistor.SchLib; ComponentLink3Description: Open Symbol; ComponentLink4URL: C:\ALTIUM_WORK\00001_MCHP-CDB\Library\Footprints\RES_C_0402.PcbLib; ComponentLink4Description: Open Footprint; ComponentLink5Description: Open Footprint 2; ComponentLink6Description: Open Footprint 3; ComponentLink7Description: Open Footprint 4; Operating Temperature: -55C to +155C; Category: Resistor; Type: RES SMD; Composition: TKF; Supplier 1: Digi-Key; Supplier Part Number 1: P10.0KLCT-ND; Quantity Override: 1
U4 = MIC8923: SAMA7G54 MPU 1000MHz Cortex-A7 TFBGA-343; Manufacturer Part Number 1: SAMA7G54-V/4HB; Manufacturer 1: Microchip; Description_: MCHP MPU 32-BIT Cortex-A7 1000MHz 128kB SAMA7G54-V/4HB TFBGA-343; Populated: YES; Dev Tools Status: Design; Owner: Ciprian Abramov; Package: TFBGA-343; MCHP-ID: MIC8923; Value: SAMA7G54; Symbol: SAMA7G54 TFBGA-343; Type: 32-Bit MPU; Status: MCL Design; Revision: 1; Category: MCHP-Microcontroller; ComponentLink1Description: SVN Datasheet; ComponentLink2Description: Local Datasheet; ComponentLink3URL: C:\ALTIUM_WORK\00001_MCHP-CDB\Library\LibraryRefs\SAMA7G54 TFBGA-343.SchLib; ComponentLink3Description: Open Symbol; ComponentLink4URL: C:\ALTIUM_WORK\00001_MCHP-CDB\Library\Footprints\TFBGA-343_14x14.PcbLib; ComponentLink4Description: Open Footprint; ComponentLink5Description: Open Footprint 2; ComponentLink6Description: Open Footprint 3; ComponentLink7Description: Open Footprint 4; Supplier 1: Microchip; Supplier Part Number 1: SAMA7G54-V/4HB; Quantity Override: 1
U5 = IC1517: Manufacturer 1: IDT, Integrated Device Technology Inc; Manufacturer Part Number 1: QS3VH257PAG; MCHP-ID: IC1517; Description_: IC SWITCHER  MUX/DEMUX IDTQS3VH257 QUAD 2:1 TSSOP-16; Dev Tools Status: Design; Owner: Ilie Galan; Populated: YES; Revision: A; Symbol: IDTQS3VH257 TSSOP-16; Status: MCL Design; Package: TSSOP-16; ComponentLink1URL: https://chn-vm-apps.microchip.com/mchprepo/parts/Datasheets/IDT_QS3VH257_DST_20140224.pdf; ComponentLink1Description: SVN Datasheet; ComponentLink2URL: C:\ALTIUM_WORK\00001_MCHP-CDB\Datasheets\IDT_QS3VH257_DST_20140224.pdf; ComponentLink2Description: Local Datasheet; ComponentLink3URL: C:\ALTIUM_WORK\00001_MCHP-CDB\Library\LibraryRefs\IDTQS3VH257 TSSOP-16.SchLib; ComponentLink3Description: Open Symbol; ComponentLink4URL: C:\ALTIUM_WORK\00001_MCHP-CDB\Library\Footprints\TSSOP-16.PcbLib; ComponentLink4Description: Open Footprint; ComponentLink5Description: Open Footprint 2; ComponentLink6Description: Open Footprint 3; ComponentLink7Description: Open Footprint 4; Operating Temperature: -40C to +85C; Type: Switcher; Category: IC; Supplier 1: Digi-Key; Supplier Part Number 1: 800-2205-ND; Quantity Override: 1